# EasyEDA schematic 1-Schematic_smart-shade.json
TITLE: Smart shade controller; REV: 1.0; Date: 2020-10-06; Sheet: 1/1; Drawn By: udinic; Company: Udinic
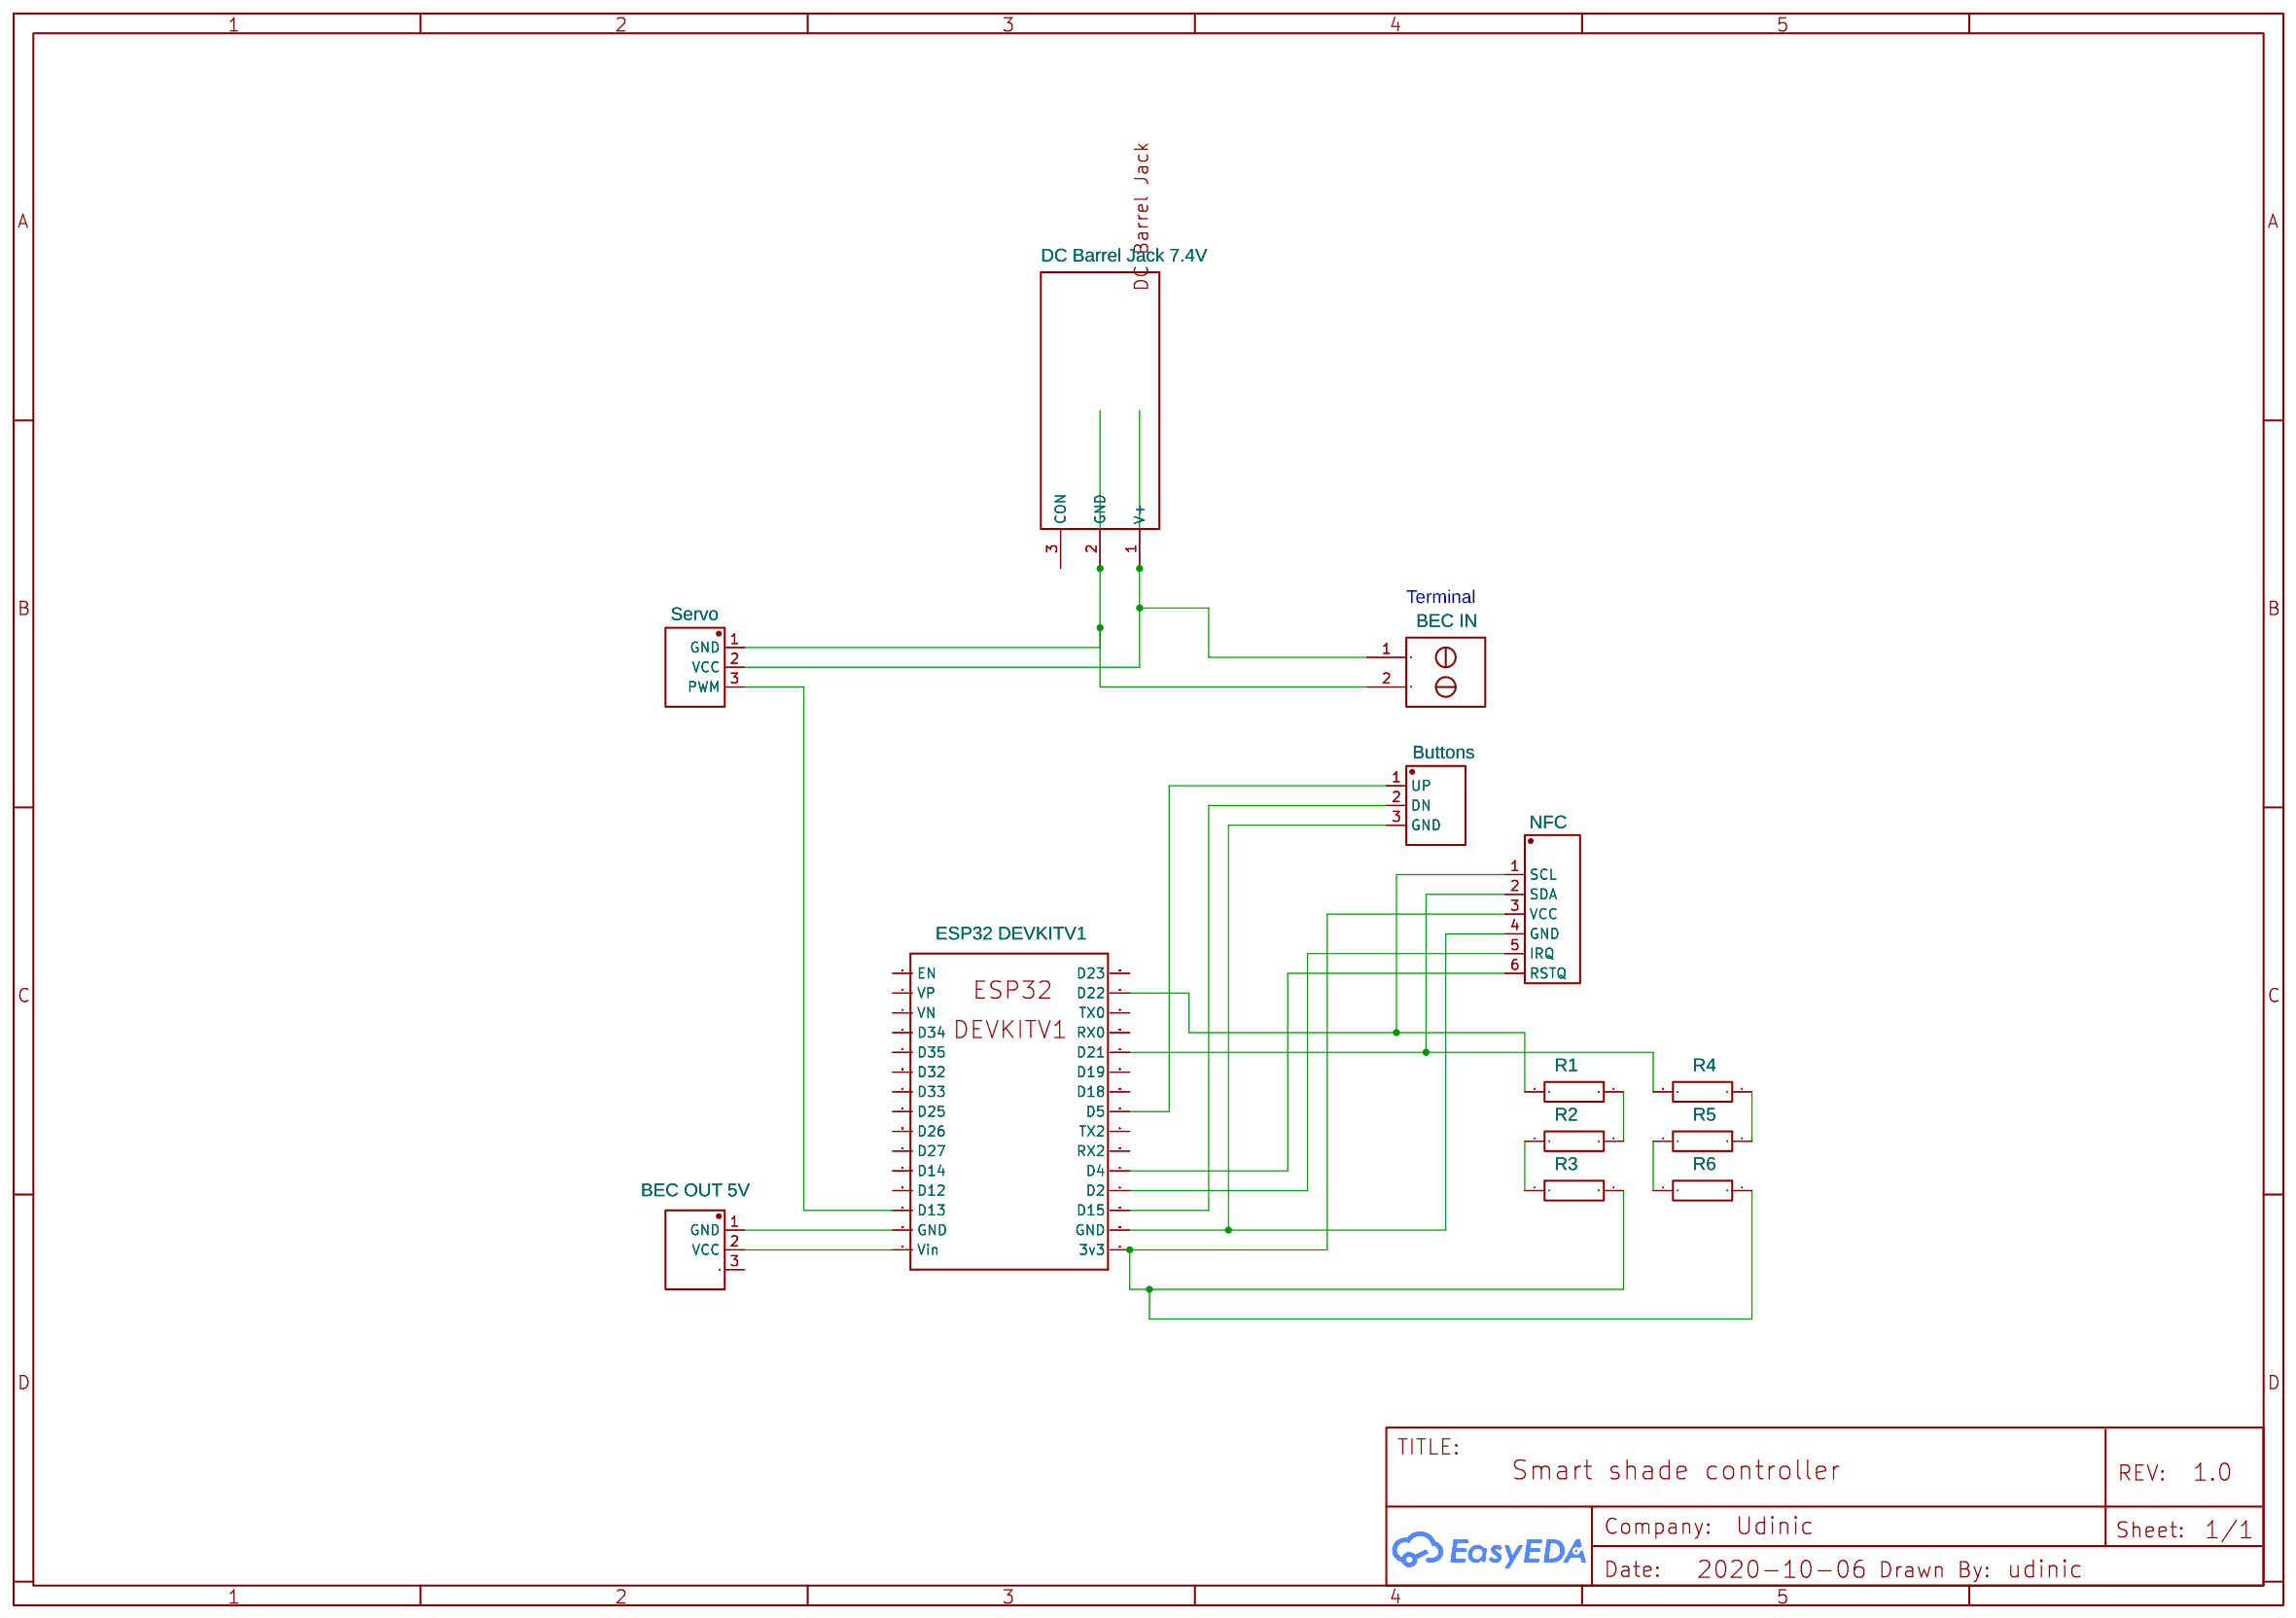
[diagram p0: schematic sheet]

## Parts
BEC-IN  BEC IN  [SCREWTERMINAL-5MM-2]
BEC-OUT  BEC OUT 5V  [HDR-TH_3P-P2.54-H-W10.0]
BTNS  Buttons  [HDR-TH_3P-P2.54-H-W10.0]
ESP32  ESP32 DEVKITV1  [ESP32 DEVELOPMENT KIT V1]
NFC  NFC  [HDR-2.54-1X13P]
R1  RESISTOR  [AXIAL-0.4]
R2  RESISTOR  [AXIAL-0.4]
R3  RESISTOR  [AXIAL-0.4]
R4  RESISTOR  [AXIAL-0.4]
R5  RESISTOR  [AXIAL-0.4]
R6  RESISTOR  [AXIAL-0.4]
SERVO  Servo  [HDR-TH_3P-P2.54-H-W10.0]
U2  DC Barrel Jack 7.4V  [DCPOWER JACK 20V4A]

## Library data of the parts
BEC-IN = Terminal, Screw, 5mm: Contributor: rickscherle
BEC-OUT SERVO = HEADERS  PINS2.54 3PINS: Supplier Part: C53043; Supplier: LCSC; Manufacturer: ReliaPro; Manufacturer Part: Headers  Pins2.54; image: http://image.lceda.cn/szlcsc/C53043.jpg; Contributor: ABSHpro elec
BTNS = HEADERS  PINS2.54 3PINS COPY: Supplier Part: C53043; Supplier: LCSC; Manufacturer: ReliaPro; Manufacturer Part: Headers  Pins2.54; image: http://image.lceda.cn/szlcsc/C53043.jpg
ESP32 = ESP32 DEVKITV1: Contributor: Александр Концевой
NFC = Headers_Pins2.54_1x6: Supplier Part: C53043; Supplier: LCSC; Manufacturer: ReliaPro; Manufacturer Part: Headers  Pins2.54; image: http://image.lceda.cn/szlcsc/C53043.jpg; Contributor: kazuhiro_h
R1-R6 = RESISTOR: Contributor: SparkFun
U2 = DC Barrel Jack 20V 4A: Contributor: Alex Bornstein; Supplier Part: 10811; Supplier: SparkFun; link: https://www.sparkfun.com/products/10811

## Nets
Net-(BEC-IN-1): BEC-IN.1 SERVO.2(VCC) U2.1(V+)
Net-(BEC-IN-2): BEC-IN.2 SERVO.1(GND) U2.2(GND)
Net-(BEC-OUT-1): BEC-OUT.1(GND) ESP32.GND#2(GND)
Net-(BEC-OUT-2): BEC-OUT.2(VCC) ESP32.Vin
Net-(BTNS-1): BTNS.1(UP) ESP32.D5
Net-(BTNS-2): BTNS.2(DN) ESP32.D15
Net-(BTNS-3): BTNS.3(GND) ESP32.GND#1(GND) NFC.4(GND)
Net-(ESP32-3v3): ESP32.3v3 NFC.3(VCC) R3.2 R6.2
Net-(ESP32-D2): ESP32.D2 NFC.5(IRQ)
Net-(ESP32-D4): ESP32.D4 NFC.6(RSTQ)
Net-(ESP32-D13): ESP32.D13 SERVO.3(PWM)
Net-(ESP32-D21): ESP32.D21 NFC.2(SDA) R4.1
Net-(ESP32-D22): ESP32.D22 NFC.1(SCL) R1.1
Net-(R1-2): R1.2 R2.2
Net-(R2-1): R2.1 R3.1
Net-(R4-2): R4.2 R5.2
Net-(R5-1): R5.1 R6.1

Not connected (* = marked no-connect by the designer): BEC-OUT 3(OFF); ESP32 D12 D14 D18 D19 D23 D25 D26 D27 D32 D33 D34 D35 EN RX0 RX2 TX0 TX2 VN VP; U2 3(CON)

## Notes on the sheet
- Terminal
